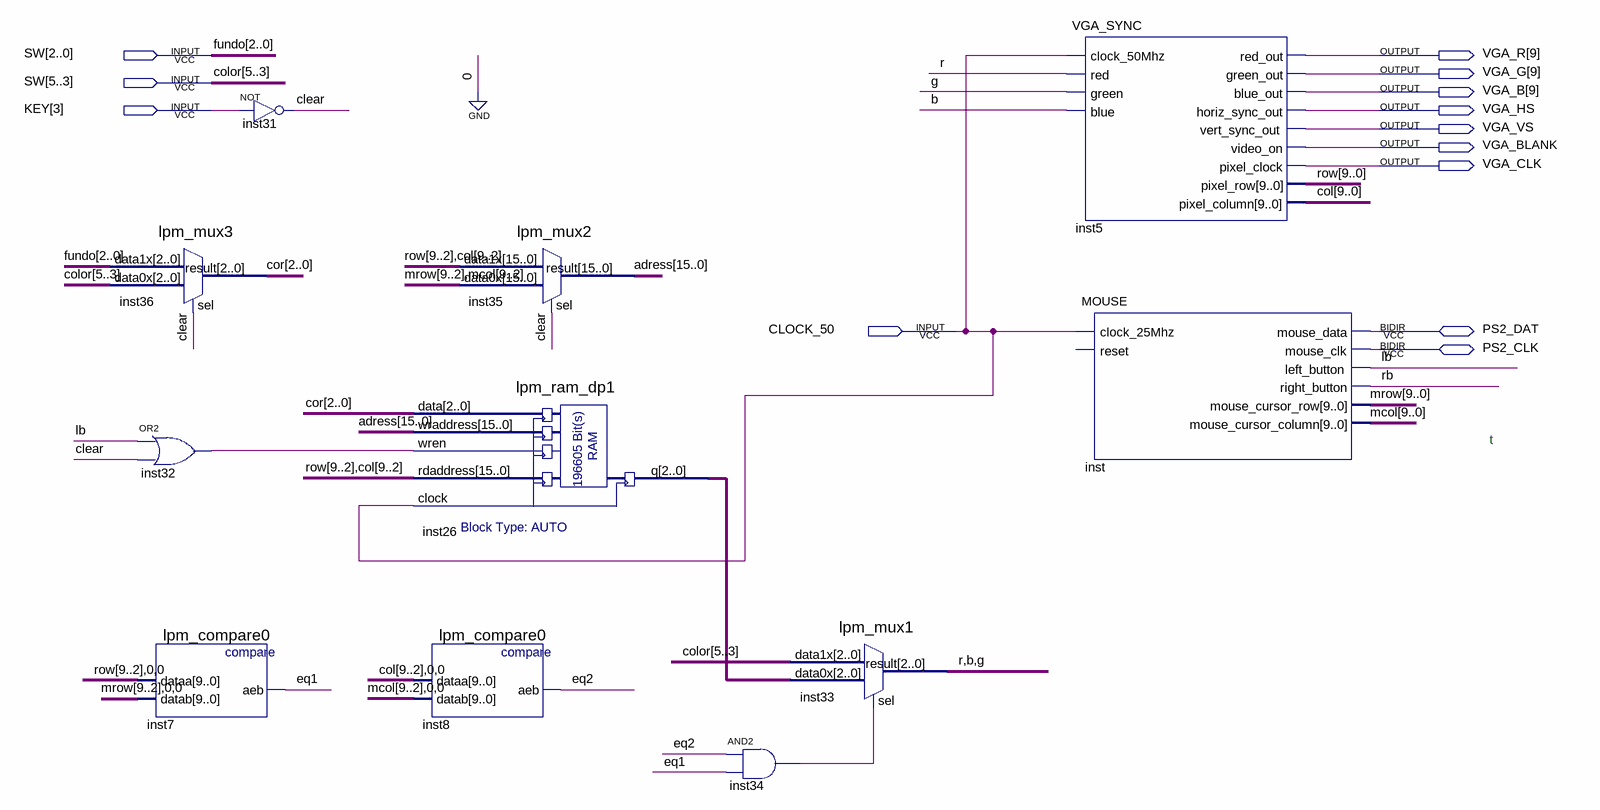
[diagram p0: schematic sheet]
// Quartus schematic desenho_rato.bdf as structural Verilog: 11 symbols, 13 pins
module desenho_rato (
  input  [5:0] SW,
  input  [3:3] KEY,
  input  CLOCK_50,
  inout  PS2_DAT,
  inout  PS2_CLK,
  output [9:9] VGA_R,
  output [9:9] VGA_G,
  output [9:9] VGA_B,
  output VGA_HS,
  output VGA_VS,
  output VGA_BLANK,
  output VGA_CLK
);

  wire b, clear, eq1, eq2, g, inst32_out, inst34_out, lb, r, rb;
  wire [2:0] cor, inst26_q;
  wire [9:0] col, mcol, mrow, row;
  wire [15:0] adress;

  lpm_mux3 inst36 (.data1x(SW[2:0]), .data0x(SW[5:3]), .sel(clear), .result(cor));
  or inst32 (inst32_out, lb, clear);
  lpm_compare0 inst7 (.dataa({row[9:2], 2'b00}), .datab({mrow[9:2], 2'b00}), .aeb(eq1));
  not inst31 (clear, KEY[3]);
  lpm_mux2 inst35 (.data1x({row[9:2], col[9:2]}), .data0x({mrow[9:2], mcol[9:2]}), .sel(clear), .result(adress));
  lpm_ram_dp1 inst26 (
    .data(cor), .wraddress(adress), .wren(inst32_out), .rdaddress({row[9:2], col[9:2]}), .clock(CLOCK_50),
    .q(inst26_q));
  lpm_compare0 inst8 (.dataa({col[9:2], 2'b00}), .datab({mcol[9:2], 2'b00}), .aeb(eq2));
  and inst34 (inst34_out, eq2, eq1);
  lpm_mux1 inst33 (.data1x(SW[5:3]), .data0x(inst26_q), .sel(inst34_out), .result({r, b, g}));
  VGA_SYNC inst5 (
    .clock_50Mhz(CLOCK_50), .red(r), .green(g), .blue(b), .red_out(VGA_R[9]), .green_out(VGA_G[9]),
    .blue_out(VGA_B[9]), .horiz_sync_out(VGA_HS), .vert_sync_out(VGA_VS), .video_on(VGA_BLANK),
    .pixel_clock(VGA_CLK), .pixel_row(row), .pixel_column(col));
  MOUSE inst (
    .clock_25Mhz(CLOCK_50), .left_button(lb), .right_button(rb), .mouse_cursor_row(mrow),
    .mouse_cursor_column(mcol), .mouse_data(PS2_DAT), .mouse_clk(PS2_CLK));  // open: reset

  // Other names for the same wires on the sheet: color[5:3] = SW[5:3]; fundo[2:0] = SW[2:0]

  // Notes on the sheet:
  //   t
endmodule
